# Altium schematic sheet Temp Bank.SchDoc
size A4; SheetNumber: 3; SheetTotal: 5
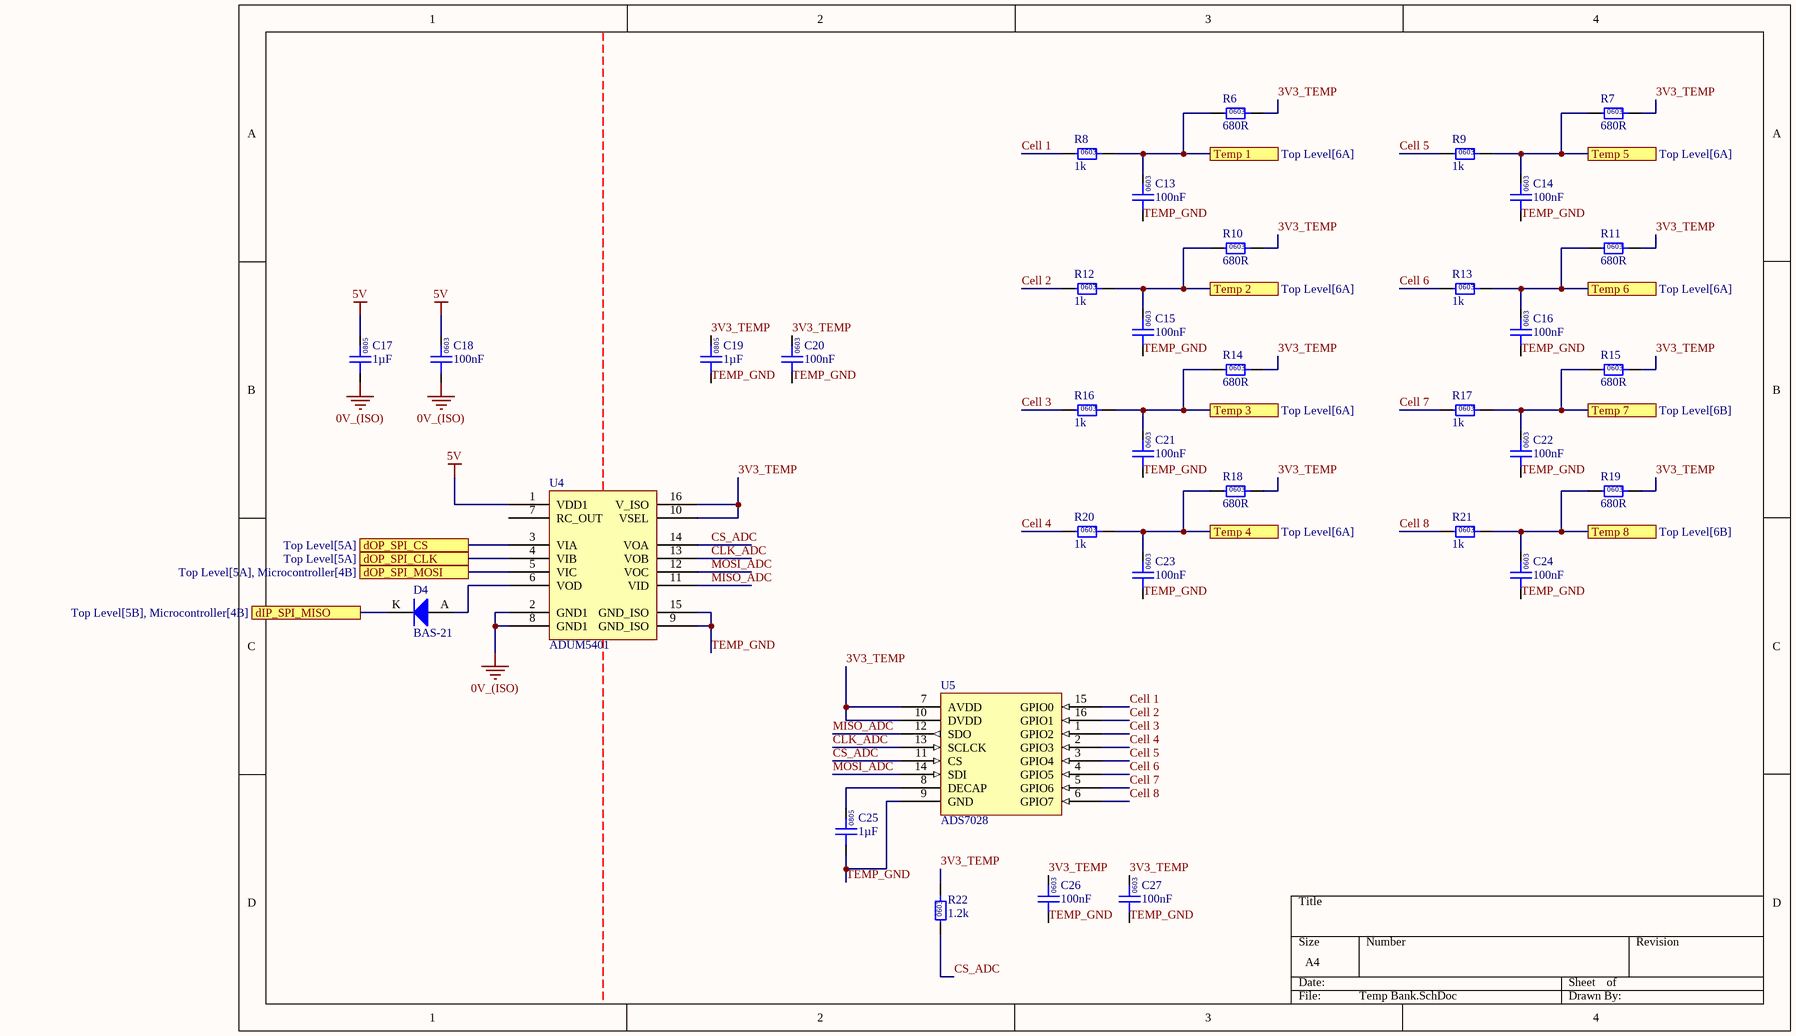
[diagram p0: Temp Bank.SchDoc]

## Parts
C13  100nF  [0603]
C14  100nF  [0603]
C15  100nF  [0603]
C16  100nF  [0603]
C17  1µF  [0805]
C18  100nF  [0603]
C19  1µF  [0805]
C20  100nF  [0603]
C21  100nF  [0603]
C22  100nF  [0603]
C23  100nF  [0603]
C24  100nF  [0603]
C25  1µF  [0805]
C26  100nF  [0603]
C27  100nF  [0603]
D4  BAS-21  [NEXPERIA_SOT23]
R6  680R  [0603]
R7  680R  [0603]
R8  1k  [0603]
R9  1k  [0603]
R10  680R  [0603]
R11  680R  [0603]
R12  1k  [0603]
R13  1k  [0603]
R14  680R  [0603]
R15  680R  [0603]
R16  1k  [0603]
R17  1k  [0603]
R18  680R  [0603]
R19  680R  [0603]
R20  1k  [0603]
R21  1k  [0603]
R22  1.2k  [0603]
U4  ADUM5401  [AD 16-SOIC]
U5  ADS7028  [WFQN-16]

## Ports
dIP_SPI_MISO (see Top Level[5B], Microcontroller[4B]), dOP_SPI_CLK (see Top Level[5A]), dOP_SPI_CS (see Top Level[5A]), dOP_SPI_MOSI (see Top Level[5A], Microcontroller[4B]), Temp 1 (see Top Level[6A]), Temp 2 (see Top Level[6A]), Temp 3 (see Top Level[6A]), Temp 4 (see Top Level[6A]), Temp 5 (see Top Level[6A]), Temp 6 (see Top Level[6A]), Temp 7 (see Top Level[6B]), Temp 8 (see Top Level[6B])

## Nets
0V_(ISO): C17.1 C18.1 U4.2(GND1) U4.8(GND1)
5V: C17.2 C18.2 U4.1(VDD1)
3V3_TEMP: C19.2 C20.2 C26.2 C27.2 R6.2 R7.2 R10.2 R11.2 R14.2 R15.2 R18.2 R19.2 R22.2 U4.10(VSEL) U4.16(V_ISO) U5.7(AVDD) U5.10(DVDD)
Cell 1: R8.1 U5.15(GPIO0)
Cell 2: R12.1 U5.16(GPIO1)
Cell 3: R16.1 U5.1(GPIO2)
Cell 4: R20.1 U5.2(GPIO3)
Cell 5: R9.1 U5.3(GPIO4)
Cell 6: R13.1 U5.4(GPIO5)
Cell 7: R17.1 U5.5(GPIO6)
Cell 8: R21.1 U5.6(GPIO7)
CLK_ADC: U4.13(VOB) U5.13(SCLCK)
CS_ADC: R22.1 U4.14(VOA) U5.11(CS)
dIP_SPI_MISO: D4.K ; port dIP_SPI_MISO
dOP_SPI_CLK: U4.4(VIB) ; port dOP_SPI_CLK
dOP_SPI_CS: U4.3(VIA) ; port dOP_SPI_CS
dOP_SPI_MOSI: U4.5(VIC) ; port dOP_SPI_MOSI
MISO_ADC: U4.11(VID) U5.12(SDO)
MOSI_ADC: U4.12(VOC) U5.14(SDI)
Temp 1: C13.2 R6.1 R8.2 ; port Temp 1
Temp 2: C15.2 R10.1 R12.2 ; port Temp 2
Temp 3: C21.2 R14.1 R16.2 ; port Temp 3
Temp 4: C23.2 R18.1 R20.2 ; port Temp 4
Temp 5: C14.2 R7.1 R9.2 ; port Temp 5
Temp 6: C16.2 R11.1 R13.2 ; port Temp 6
Temp 7: C22.2 R15.1 R17.2 ; port Temp 7
Temp 8: C24.2 R19.1 R21.2 ; port Temp 8
TEMP_GND: C13.1 C14.1 C15.1 C16.1 C19.1 C20.1 C21.1 C22.1 C23.1 C24.1 C25.1 C26.1 C27.1 U4.9(GND_ISO) U4.15(GND_ISO) U5.9(GND)
NetC25_2: C25.2 U5.8(DECAP)
NetD4_A: D4.A U4.6(VOD)

Not connected (* = marked no-connect by the designer): U4 7(RC_OUT)

## Notes on the sheet
- (in symbol GCM21BR71H105KA03L) 0805
- (in symbol GCM188L81H104KA57D) 0603
- (in symbol RC0603FR-071KL) 0603
- (in symbol RC0603JR-071K2L) 0603
- (in symbol RC0603JR-13680RL) 0603

## Library data of the parts
C13-C16 C18 C20-C24 C26 C27 = GCM188L81H104KA57D: Manufacturer: muRata; Rated Voltage: 50V; Tolerance: ±10%; Material: MLCC; Temperature Rating: X8L; Part Number: GCM188L81H104KA57D; Value: 100nF; Digikey Part Number: 490-6049-1-ND
C17 C19 C25 = GCM21BR71H105KA03L: Manufacturer: muRata; Rated Voltage: 50V; Tolerance: ±10%; Material: MLCC; Temperature Rating: X7R; Part Number: GCM21BR71H105KA03L; Value: 1µF; Digikey Part Number: 490-10675-1-ND
D4 = BAS-21: Manufacturer: Nexperia USA Inc.; Forward Voltage: 1.0V; Breakdown Voltage: 250V; Rated Power: 250mW; Part Number: BAS-21
R6 R7 R10 R11 R14 R15 R18 R19 = RC0603JR-13680RL: Manufacturer: YAGEO; Tolerance: 0.01; Rated Power: 0.1W; Part Number: RC0603JR-13680RL; Value: 680R; Material: FR-07; Digikey Part Number: 13-RC0603JR-13680RLCT-ND
R8 R9 R12 R13 R16 R17 R20 R21 = RC0603FR-071KL: Manufacturer: YAGEO; Tolerance: 0.01; Rated Power: 0.1W; Part Number: RC0603FR-071KL; Value: 1k; Material: FR-07; Digikey Part Number: 311-1.00KHRCT-ND
R22 = RC0603JR-071K2L: Manufacturer: YAGEO; Tolerance: 0.01; Rated Power: 0.1W; Part Number: RC0603JR-071K2L; Value: 1.2k; Material: FR-07; Digikey Part Number: 311-1.2KGRCT-ND
U4 = ADUM5401: Quad Channel 2.5kV Digital Isolator with isoPower; Manufacturer: Analogue Devices; Part Number: ADUM5401
U5 = ADS7028IRTER: IC ADC 12BIT SAR 16WQFN; Manufacturer: Texas Instruments; Part Number: ADS7028IRTER; Digikey Part Number: ADS7028IRTER; Digikey Link: https://www.digikey.com.au/en/products/detail/texas-instruments/ADS7028IRTER/12696020?s=N4IgTCBcDaIIIBEDKB2ADGAHASQEoBUBRXEAXQF8g